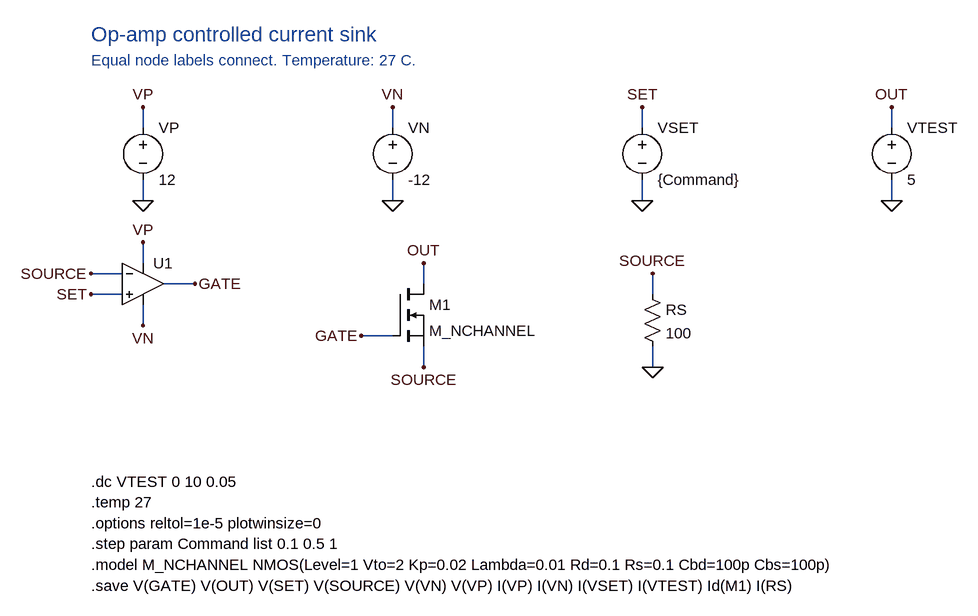
[diagram p0: schematic opamp-current-source.asc]
opamp-current-source.asc, the LTspice schematic file:
Version 4
SHEET 1 1740 1032
WIRE 144 176 144 144
WIRE 144 256 144 288
WIRE 528 176 528 144
WIRE 528 256 528 288
WIRE 912 176 912 144
WIRE 912 256 912 288
WIRE 1296 176 1296 144
WIRE 1296 256 1296 288
WIRE 112 432 64 432
WIRE 112 400 64 400
WIRE 144 384 144 352
WIRE 144 448 144 480
WIRE 176 416 224 416
WIRE 576 416 576 384
WIRE 528 496 480 496
WIRE 576 512 576 544
WIRE 928 432 928 400
WIRE 928 512 928 544
FLAG 144 144 VP
FLAG 144 288 0
FLAG 528 144 VN
FLAG 528 288 0
FLAG 912 144 SET
FLAG 912 288 0
FLAG 1296 144 OUT
FLAG 1296 288 0
FLAG 64 432 SET
FLAG 64 400 SOURCE
FLAG 144 352 VP
FLAG 144 480 VN
FLAG 224 416 GATE
FLAG 576 384 OUT
FLAG 480 496 GATE
FLAG 576 544 SOURCE
FLAG 928 400 SOURCE
FLAG 928 544 0
SYMBOL voltage 144 160 R0
SYMATTR InstName VP
SYMATTR Value 12
SYMBOL voltage 528 160 R0
SYMATTR InstName VN
SYMATTR Value -12
SYMBOL voltage 912 160 R0
SYMATTR InstName VSET
SYMATTR Value {Command}
SYMBOL voltage 1296 160 R0
SYMATTR InstName VTEST
SYMATTR Value 5
SYMBOL OpAmps/UniversalOpamp2 144 416 R0
SYMATTR InstName U1
SYMATTR SpiceModel level2
SYMATTR Value2 Avol=1Meg GBW=10Meg Slew=10Meg
SYMATTR SpiceLine Ilimit=100m Rail=0.5 Vos=0
SYMATTR SpiceLine2 En=0 Enk=0 In=0 Ink=0 Rin=1G
SYMBOL nmos 528 416 R0
SYMATTR InstName M1
SYMATTR Value M_NCHANNEL
SYMBOL res 912 416 R0
SYMATTR InstName RS
SYMATTR Value 100
TEXT 64 32 Left 3 ;Op-amp controlled current sink
TEXT 64 72 Left 2 ;Equal node labels connect. Temperature: 27 C.
TEXT 64 720 Left 2 !.dc VTEST 0 10 0.05
TEXT 64 752 Left 2 !.temp 27
TEXT 64 784 Left 2 !.options reltol=1e-5 plotwinsize=0
TEXT 64 816 Left 2 !.step param Command list 0.1 0.5 1
TEXT 64 848 Left 2 !.model M_NCHANNEL NMOS(Level=1 Vto=2 Kp=0.02 Lambda=0.01 Rd=0.1 Rs=0.1 Cbd=100p Cbs=100p)
TEXT 64 880 Left 2 !.save V(GATE) V(OUT) V(SET) V(SOURCE) V(VN) V(VP) I(VP) I(VN) I(VSET) I(VTEST) Id(M1) I(RS)

The netlist it stands for:
* opamp-current-source.asc
VP VP 0 12
VN VN 0 -12
VSET SET 0 {Command}
VTEST OUT 0 5
XU1 SET SOURCE VP VN GATE level2 Avol=1Meg GBW=10Meg Slew=10Meg Ilimit=100m Rail=0.5 Vos=0 En=0 Enk=0 In=0 Ink=0 Rin=1G  ; pins In+ In- V+ V- OUT
M1 OUT GATE SOURCE SOURCE M_NCHANNEL
RS SOURCE 0 100
.model NMOS NMOS
.model PMOS PMOS
.lib standard.mos
* Op-amp controlled current sink
* Equal node labels connect. Temperature: 27 C.
.dc VTEST 0 10 0.05
.temp 27
.options reltol=1e-5 plotwinsize=0
.step param Command list 0.1 0.5 1
.model M_NCHANNEL NMOS(Level=1 Vto=2 Kp=0.02 Lambda=0.01 Rd=0.1 Rs=0.1 Cbd=100p Cbs=100p)
.save V(GATE) V(OUT) V(SET) V(SOURCE) V(VN) V(VP) I(VP) I(VN) I(VSET) I(VTEST) Id(M1) I(RS)
.lib UniversalOpAmp2.lib
.backanno
.end